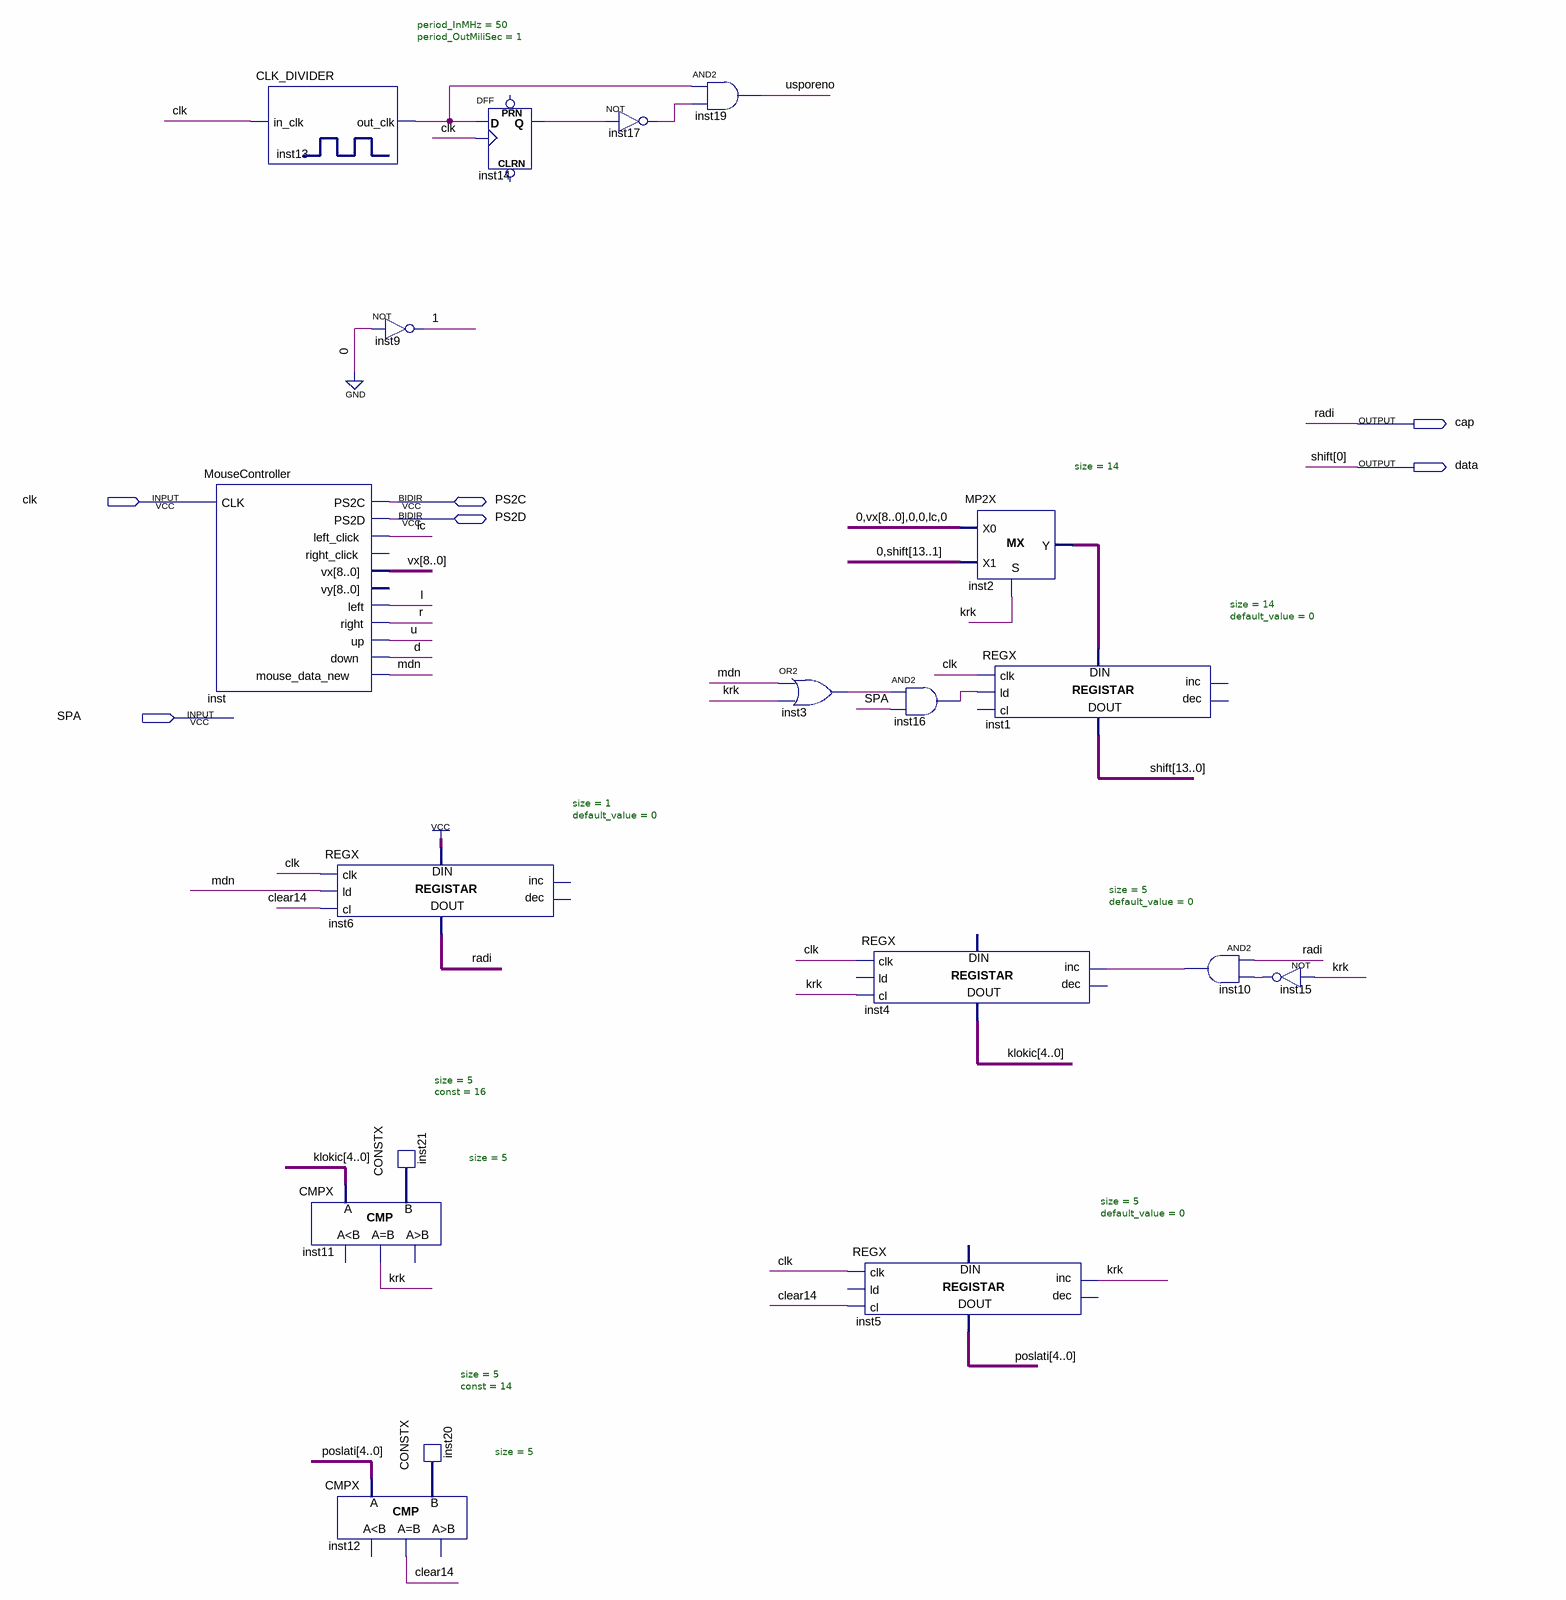
[diagram p0: schematic sheet]
// Quartus schematic saljem.bdf as structural Verilog: 19 symbols, 6 pins
module saljem (
  input  clk,
  input  SPA,
  inout  PS2C,
  inout  PS2D,
  output cap,
  output data
);

  wire \1 , clear14, d, inst3_out, inst10_out, inst13_out_clk, inst14_q, inst15_out, inst16_out, inst17_out,
       krk, l, lc, mdn, r, u, usporeno;
  wire [4:0] inst20_data, inst21_data, klokic, poslati;
  wire [8:0] vx;
  wire [13:0] inst2_y;
  wire [13:1] shift;

  MouseController inst (
    .CLK(clk), .left_click(lc), .vx(vx), .left(l), .right(r), .up(u), .down(d), .mouse_data_new(mdn),
    .PS2C(PS2C), .PS2D(PS2D));  // open: right_click, vy
  CLK_DIVIDER #(.period_InMHz(50), .period_OutMiliSec(1)) inst13 (.in_clk(clk), .out_clk(inst13_out_clk));
  CMPX #(.size(5)) inst11 (.A(klokic), .B(inst21_data), .eq(krk));  // open: ls, gr
  REGX #(.size(1), .default_value(0)) inst6 (
    .clk(clk), .ld(mdn), .cl(clear14), .data_in(1'b1), .data_out(cap));  // open: inc, dec
  CMPX #(.size(5)) inst12 (.A(poslati), .B(inst20_data), .eq(clear14));  // open: ls, gr
  not inst9 (\1 , 1'b0);
  CONSTX #(.size(5), .\const (16)) inst21 (.data(inst21_data));
  CONSTX #(.size(5), .\const (14)) inst20 (.data(inst20_data));
  DFF inst14 (.CLK(clk), .D(inst13_out_clk), .Q(inst14_q));  // open: CLRN, PRN
  not inst17 (inst17_out, inst14_q);
  and inst19 (usporeno, inst13_out_clk, inst17_out);
  or inst3 (inst3_out, mdn, krk);
  REGX #(.size(5), .default_value(0)) inst5 (
    .clk(clk), .cl(clear14), .inc(krk), .data_out(poslati));  // open: ld, dec, data_in
  and inst16 (inst16_out, inst3_out, SPA);
  REGX #(.size(5), .default_value(0)) inst4 (
    .clk(clk), .cl(krk), .inc(inst10_out), .data_out(klokic));  // open: ld, dec, data_in
  MP2X #(.size(14)) inst2 (.S(krk), .X0({1'b0, vx, 2'b00, lc, 1'b0}), .X1({1'b0, shift}), .Y(inst2_y));
  REGX #(.size(14), .default_value(0)) inst1 (
    .clk(clk), .ld(inst16_out), .data_in(inst2_y), .data_out({shift, data}));  // open: cl, inc, dec
  and inst10 (inst10_out, cap, inst15_out);
  not inst15 (inst15_out, krk);

  // Other names for the same wires on the sheet: radi = cap; shift[0] = data
endmodule
